# EAGLE design breakout (EAGLE 7.5.0)
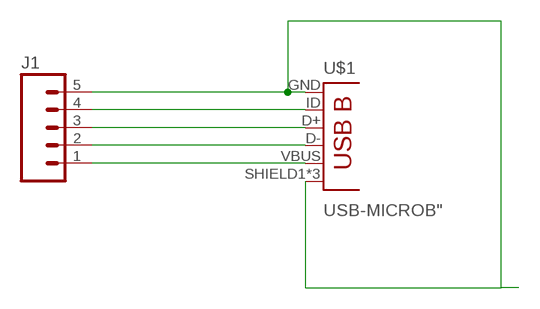
[diagram p0: schematic, sheet 1]

## Parts
J1  M05PTH  [1X05]
U$1  USB-MICROB"  [USB-B-MICRO-SMD_V03]

## Nets
N$1: J1.5 U$1.GND U$1.SHIELD1(SHIELD) U$1.SHIELD2(SHIELD) U$1.SHIELD3(SHIELD)
N$2: J1.4 U$1.ID(USBID)
N$3: J1.3 U$1.D+
N$4: J1.2 U$1.D-
N$5: J1.1 U$1.VBUS

## Library data of the parts
J1 = SparkFun-Connectors:M05: Header 5 Standard 5-pin 0.1" header. Use with straight break away headers (SKU : PRT-00116), right angle break away headers (PRT-00553), swiss pins (PRT-00743), machine pins (PRT-00117), and female headers (PRT-00115). Molex polarized connector foot print use with SKU : PRT-08230 with associated crimp pins and housings.
U$1 = SparkFun-Connectors:USB-MICROB; PROD_ID: CONN-11752

## Board
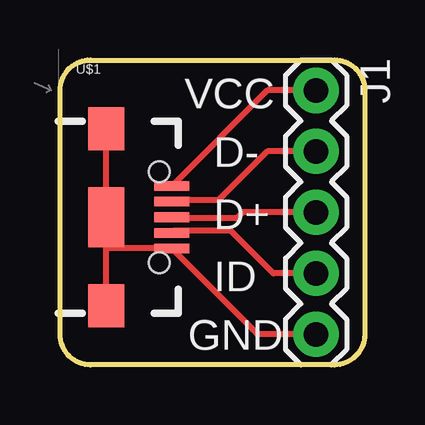
[diagram p1: board, top side]
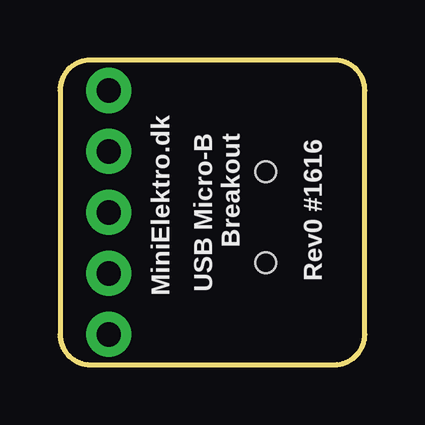
[diagram p2: board, bottom side, seen from below]

Size 12.7 x 12.7 mm. Coordinates in mm from the lower left corner, seen from the top.
Outline: 0,1.27 0,11.43 arc-90 1.27,12.7 11.43,12.7 arc-90 12.7,11.43 12.7,1.27 arc-90 11.43,0 1.27,0 arc-90 0,1.27
Copper layers (1*16): Top 0.035mm / dielectric 1.5mm / Bottom 0.035mm
Design rules "default": minimum track width 10mil, minimum drill 24mil, track to track 8mil, track to pad 8mil, pad to pad 8mil, via to via 8mil, smd to smd 8mil, copper to edge 40mil, drill to drill 8mil, minimum pad ring 10mil, minimum via ring 8mil, stop-mask expansion 4mil, vias tented up to drill 0mil, thermal gap 10mil

### Footprints (pad centres in the part's own frame; a part is rotated, then mirrored left to right if it is on the bottom)
1X05 = drill 1.016 pad 1.88: 1 0,0; 2 2.54,0; 3 5.08,0; 4 7.62,0; 5 10.16,0
USB-B-MICRO-SMD_V03 = smd 1.45 x 0.4: D+ 2.725,0; D- 2.725,0.65; GND 2.725,-1.3; ID 2.725,-0.65; VBUS 2.725,1.3 | smd 1.5 x 1.8: SHIELD1 0,3.685; SHIELD2 0,-3.685 | smd 1.5 x 2.5: SHIELD3 0,0 | hole 0.85: 2.2,1.9; 2.2,-1.9

### Placement (x,y rotation side)
J1  10.67,11.43 270 top
U$1  1.93,6.15 0 top

### Tracks (layer width: path | path; a pad name or v marks a point on that pad's centre or on a via)
N$1
  Top 0.254: J1.5 8.23,1.27 U$1.GND 1.95,4.85 1.93,4.83 | U$1.SHIELD2 1.93,4.83 | 1.93,4.83 U$1.SHIELD3 U$1.SHIELD1
N$2
  Top 0.254: J1.4 8.89,3.81 7.11,5.59 4.75,5.59 U$1.ID
N$3
  Top 0.254: J1.3 7.62,6.35 7.37,6.1 4.71,6.1 U$1.D+
N$4
  Top 0.254: J1.2 8.64,8.89 6.6,6.86 4.72,6.86 U$1.D-
N$5
  Top 0.254: J1.1 8.64,11.43 U$1.VBUS

### Text on the board
tPlace: VCC | D- | D+ | ID | GND
bPlace: USB Micro-B / Breakout | MiniElektro.dk | Rev0 #1616